# EAGLE design MoCAM80 (EAGLE 9.7.0)
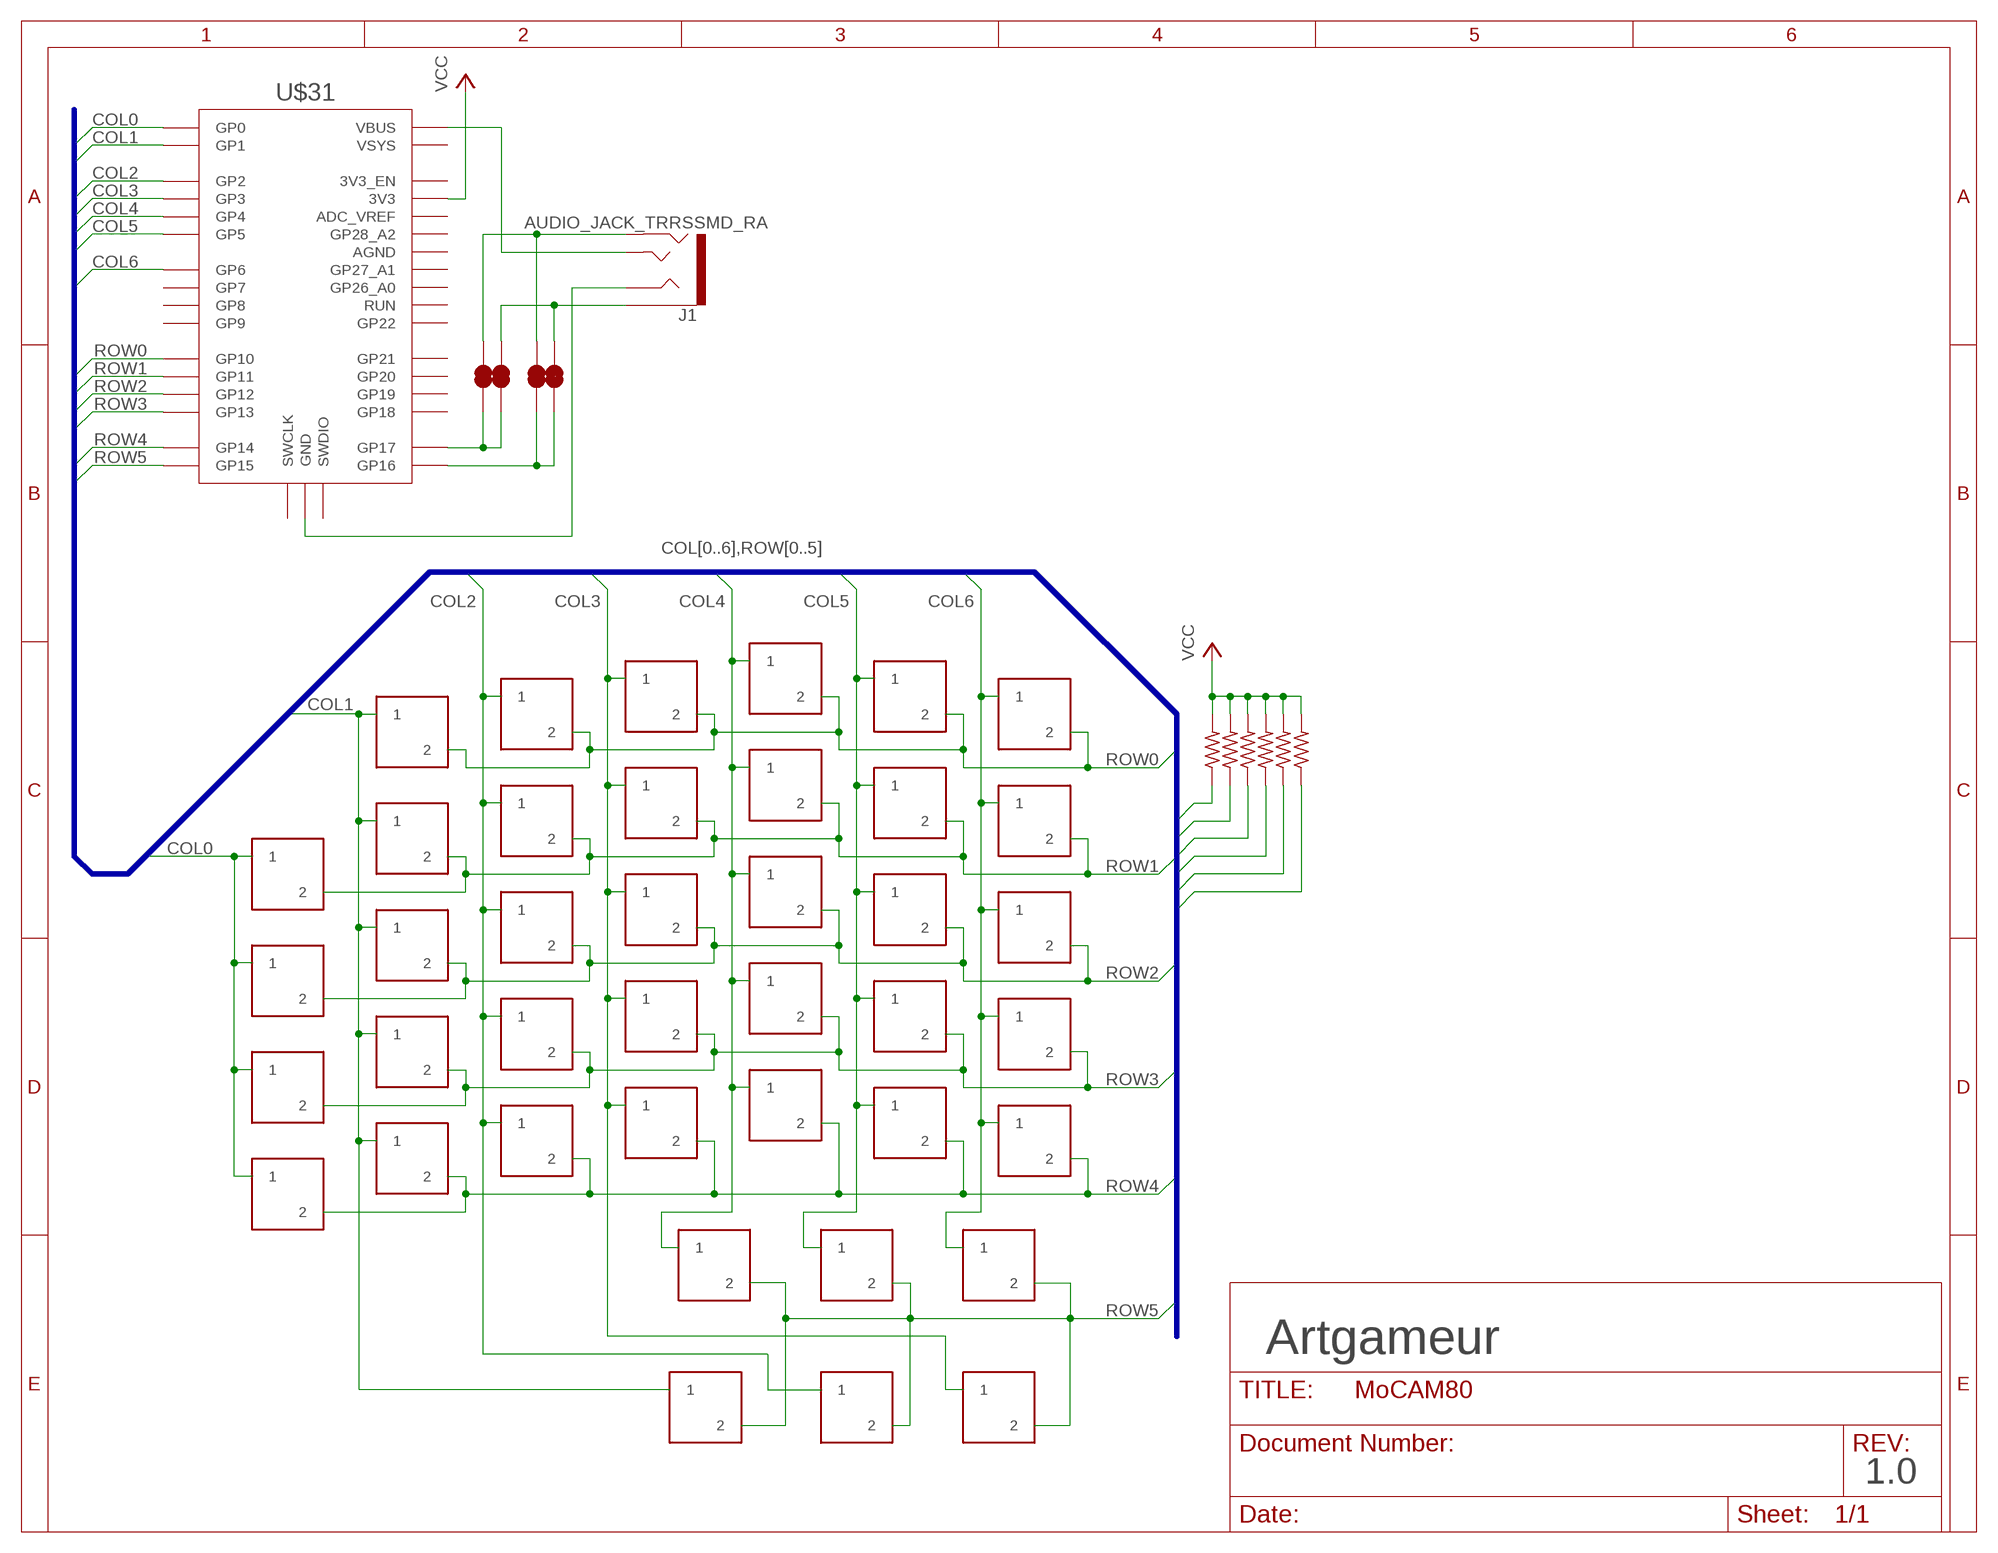
[diagram p0: schematic, sheet 1]

## Parts
J1  AUDIO_JACK_TRRSSMD_RA  [AUDIO_JACK_3.5MM_TRRS_SMD_RA]
JP1  JUMPER-SMT_2_NC_TRACE_NO-SILK  [SMT-JUMPER_2_NC_TRACE_NO-SILK]
JP2  JUMPER-SMT_2_NC_TRACE_NO-SILK  [SMT-JUMPER_2_NC_TRACE_NO-SILK]
JP3  JUMPER-SMT_2_NC_TRACE_NO-SILK  [SMT-JUMPER_2_NC_TRACE_NO-SILK]
JP4  JUMPER-SMT_2_NC_TRACE_NO-SILK  [SMT-JUMPER_2_NC_TRACE_NO-SILK]
R1  R-US_CHIP-1206(3216-METRIC)  [RESC3216X70]
R2  R-US_CHIP-1206(3216-METRIC)  [RESC3216X70]
R3  R-US_CHIP-1206(3216-METRIC)  [RESC3216X70]
R4  R-US_CHIP-1206(3216-METRIC)  [RESC3216X70]
R5  R-US_CHIP-1206(3216-METRIC)  [RESC3216X70]
R6  R-US_CHIP-1206(3216-METRIC)  [RESC3216X70]
U$1  KEYBOARD_SWITCHMX_CHOC_V2_SWAP  [MX_CHOC_V2_SWAP]
U$2  KEYBOARD_SWITCHMX_CHOC_V2_SWAP  [MX_CHOC_V2_SWAP]
U$3  KEYBOARD_SWITCHMX_CHOC_V2_SWAP  [MX_CHOC_V2_SWAP]
U$4  KEYBOARD_SWITCHMX_CHOC_V2_SWAP  [MX_CHOC_V2_SWAP]
U$5  KEYBOARD_SWITCHMX_CHOC_V2_SWAP  [MX_CHOC_V2_SWAP]
U$6  KEYBOARD_SWITCHMX_CHOC_V2_SWAP  [MX_CHOC_V2_SWAP]
U$7  KEYBOARD_SWITCHMX_CHOC_V2_SWAP  [MX_CHOC_V2_SWAP]
U$8  KEYBOARD_SWITCHMX_CHOC_V2_SWAP  [MX_CHOC_V2_SWAP]
U$9  KEYBOARD_SWITCHMX_CHOC_V2_SWAP  [MX_CHOC_V2_SWAP]
U$10  KEYBOARD_SWITCHMX_CHOC_V2_SWAP  [MX_CHOC_V2_SWAP]
U$11  KEYBOARD_SWITCHMX_CHOC_V2_SWAP  [MX_CHOC_V2_SWAP]
U$12  KEYBOARD_SWITCHMX_CHOC_V2_SWAP  [MX_CHOC_V2_SWAP]
U$13  KEYBOARD_SWITCHMX_CHOC_V2_SWAP  [MX_CHOC_V2_SWAP]
U$14  KEYBOARD_SWITCHMX_CHOC_V2_SWAP  [MX_CHOC_V2_SWAP]
U$15  KEYBOARD_SWITCHMX_CHOC_V2_SWAP  [MX_CHOC_V2_SWAP]
U$16  KEYBOARD_SWITCHMX_CHOC_V2_SWAP  [MX_CHOC_V2_SWAP]
U$17  KEYBOARD_SWITCHMX_CHOC_V2_SWAP  [MX_CHOC_V2_SWAP]
U$18  KEYBOARD_SWITCHMX_CHOC_V2_SWAP  [MX_CHOC_V2_SWAP]
U$19  KEYBOARD_SWITCHMX_CHOC_V2_SWAP  [MX_CHOC_V2_SWAP]
U$20  KEYBOARD_SWITCHMX_CHOC_V2_1.25  [MX_CHOC_V2_1.25]
U$21  KEYBOARD_SWITCHMX_CHOC_V2_SWAP  [MX_CHOC_V2_SWAP]
U$22  KEYBOARD_SWITCHMX_CHOC_V2_SWAP  [MX_CHOC_V2_SWAP]
U$23  KEYBOARD_SWITCHMX_CHOC_V2_SWAP  [MX_CHOC_V2_SWAP]
U$24  KEYBOARD_SWITCHMX_CHOC_V2_SWAP  [MX_CHOC_V2_SWAP]
U$25  KEYBOARD_SWITCHMX_CHOC_V2_1.25  [MX_CHOC_V2_1.25]
U$26  KEYBOARD_SWITCHMX_CHOC_V2_SWAP  [MX_CHOC_V2_SWAP]
U$27  KEYBOARD_SWITCHMX_CHOC_V2_SWAP  [MX_CHOC_V2_SWAP]
U$28  KEYBOARD_SWITCHMX_CHOC_V2_SWAP  [MX_CHOC_V2_SWAP]
U$29  KEYBOARD_SWITCHMX_CHOC_V2_SWAP  [MX_CHOC_V2_SWAP]
U$30  KEYBOARD_SWITCHMX_CHOC_V2_1.5  [MX_CHOC_V2_1.5]
U$31  RPI_PICO-SMD  [RPI_PICO]
U$32  KEYBOARD_SWITCHMX_CHOC_V2_SWAP  [MX_CHOC_V2_SWAP]
U$33  KEYBOARD_SWITCHMX_CHOC_V2_SWAP  [MX_CHOC_V2_SWAP]
U$34  KEYBOARD_SWITCHMX_CHOC_V2_SWAP  [MX_CHOC_V2_SWAP]
U$35  KEYBOARD_SWITCHMX_CHOC_V2_SWAP  [MX_CHOC_V2_SWAP]
U$36  KEYBOARD_SWITCHMX_CHOC_V2_SWAP  [MX_CHOC_V2_SWAP]
U$37  KEYBOARD_SWITCHMX_CHOC_V2_SWAP  [MX_CHOC_V2_SWAP]
U$38  KEYBOARD_SWITCHMX_CHOC_V2_SWAP  [MX_CHOC_V2_SWAP]
U$39  KEYBOARD_SWITCHMX_CHOC_V2_1.5  [MX_CHOC_V2_1.5]
U$40  KEYBOARD_SWITCHMX_CHOC_V2_1.5  [MX_CHOC_V2_1.5]
U$41  KEYBOARD_SWITCHMX_CHOC_V2_1.5  [MX_CHOC_V2_1.5]

## Nets
COL0: U$1.P$1 U$1.P$4 U$2.P$1 U$2.P$4 U$3.P$1 U$3.P$4 U$31.GP0 U$38.P$1 U$38.P$4
COL1: U$4.P$1 U$4.P$4 U$5.P$1 U$5.P$4 U$6.P$1 U$6.P$4 U$7.P$1 U$7.P$4 U$20.P$1 U$20.P$4 U$31.GP1 U$32.P$1 U$32.P$4
COL2: U$8.P$1 U$8.P$4 U$9.P$1 U$9.P$4 U$10.P$1 U$10.P$4 U$11.P$1 U$11.P$4 U$25.P$1 U$25.P$4 U$31.GP2 U$33.P$1 U$33.P$4
COL3: U$12.P$1 U$12.P$4 U$13.P$1 U$13.P$4 U$14.P$1 U$14.P$4 U$15.P$1 U$15.P$4 U$31.GP3 U$34.P$1 U$34.P$4 U$39.P$1 U$39.P$4
COL4: U$16.P$1 U$16.P$4 U$17.P$1 U$17.P$4 U$18.P$1 U$18.P$4 U$19.P$1 U$19.P$4 U$30.P$1 U$30.P$4 U$31.GP4 U$35.P$1 U$35.P$4
COL5: U$21.P$1 U$21.P$4 U$22.P$1 U$22.P$4 U$23.P$1 U$23.P$4 U$24.P$1 U$24.P$4 U$31.GP5 U$36.P$1 U$36.P$4 U$40.P$1 U$40.P$4
COL6: U$26.P$1 U$26.P$4 U$27.P$1 U$27.P$4 U$28.P$1 U$28.P$4 U$29.P$1 U$29.P$4 U$31.GP6 U$37.P$1 U$37.P$4 U$41.P$1 U$41.P$4
JACK_1: J1.TIP U$31.VBUS
JACK_2: J1.RING2 JP2.2 JP4.2
JACK_GND: J1.RING1 U$31.GND@1(GND) U$31.GND@2(GND) U$31.GND@3(GND) U$31.GND@4(GND) U$31.GND@5(GND) U$31.GND@6(GND) U$31.GND@7(GND) U$31.GND@8(GND)
JACK_TIP: J1.EARTH JP1.2 JP3.2
ROW0: R6.1 U$31.GP10 U$32.P$2 U$33.P$2 U$34.P$2 U$35.P$2 U$36.P$2 U$37.P$2
ROW1: R1.1 U$4.P$2 U$8.P$2 U$12.P$2 U$16.P$2 U$21.P$2 U$26.P$2 U$31.GP11 U$38.P$2
ROW2: R2.1 U$1.P$2 U$5.P$2 U$9.P$2 U$13.P$2 U$17.P$2 U$22.P$2 U$27.P$2 U$31.GP12
ROW3: R3.1 U$2.P$2 U$6.P$2 U$10.P$2 U$14.P$2 U$18.P$2 U$23.P$2 U$28.P$2 U$31.GP13
ROW4: R4.1 U$3.P$2 U$7.P$2 U$11.P$2 U$15.P$2 U$19.P$2 U$24.P$2 U$29.P$2 U$31.GP14
ROW5: R5.1 U$20.P$2 U$25.P$2 U$30.P$2 U$31.GP15 U$39.P$2 U$40.P$2 U$41.P$2
UART_RX: JP1.1 JP4.1 U$31.GP17
UART_TX: JP2.1 JP3.1 U$31.GP16
VCC: R1.2 R2.2 R3.2 R4.2 R5.2 R6.2 U$31.3V3
Unconnected: U$31.3V3_EN U$31.ADC_VREF U$31.AGND U$31.GP7 U$31.GP8 U$31.GP9 U$31.GP18 U$31.GP19 U$31.GP20 U$31.GP21 U$31.GP22 U$31.GP26_A0 U$31.GP27_A1 U$31.GP28_A2 U$31.RUN U$31.SWCLK U$31.SWDIO U$31.VSYS

## Buses
COL[0..6],ROW[0..5]

## Notes on the sheet
- Artgameur
- 1.0

## Library data of the parts
J1 = MoCAM80-Lib:AUDIO_JACK_TRRS: Audio Jack - 3.5mm TRRS (SMD) This is a 3.5mm TRRS SMD audio jack. TRRS connectors are the audio-style connectors that you see on some phones, MP3 players and development boards. TRRS stands for “tip, ring, ring, sleeve,” which reflects that this has three conductors and a ground. SparkFun Products: Audio Jack <https://www.sparkfun.com/products/12639> mbed Starter Kit <https://www.sparkfun.com/products/12968> SparkFun TRRS 3.5mm Jack Breakout <https://www.sparkfun.com/products/11570>
JP1-JP4 = MoCAM80-Lib:JUMPER-SMT_2_NC_TRACE: Normally closed trace jumper This jumper has a trace between two pads so it's normally closed (NC). Use a razor knife to open the connection. For best results follow the IPC guidelines for cutting traces: Cutout at least 0.063 mm (0.005 in). Remove all loose material to clean up the cut area. Seal the cut with an approved epoxy. Reapply solder to reclose the connection.
R1-R6 = MoCAM80-Lib:R-US: Resistor Fixed - ANSI
U$1-U$30 U$32-U$41 = MoCAM80-Lib:KEYBOARD_SWITCH
U$31 = MoCAM80-Lib:RPI_PICO

## Board
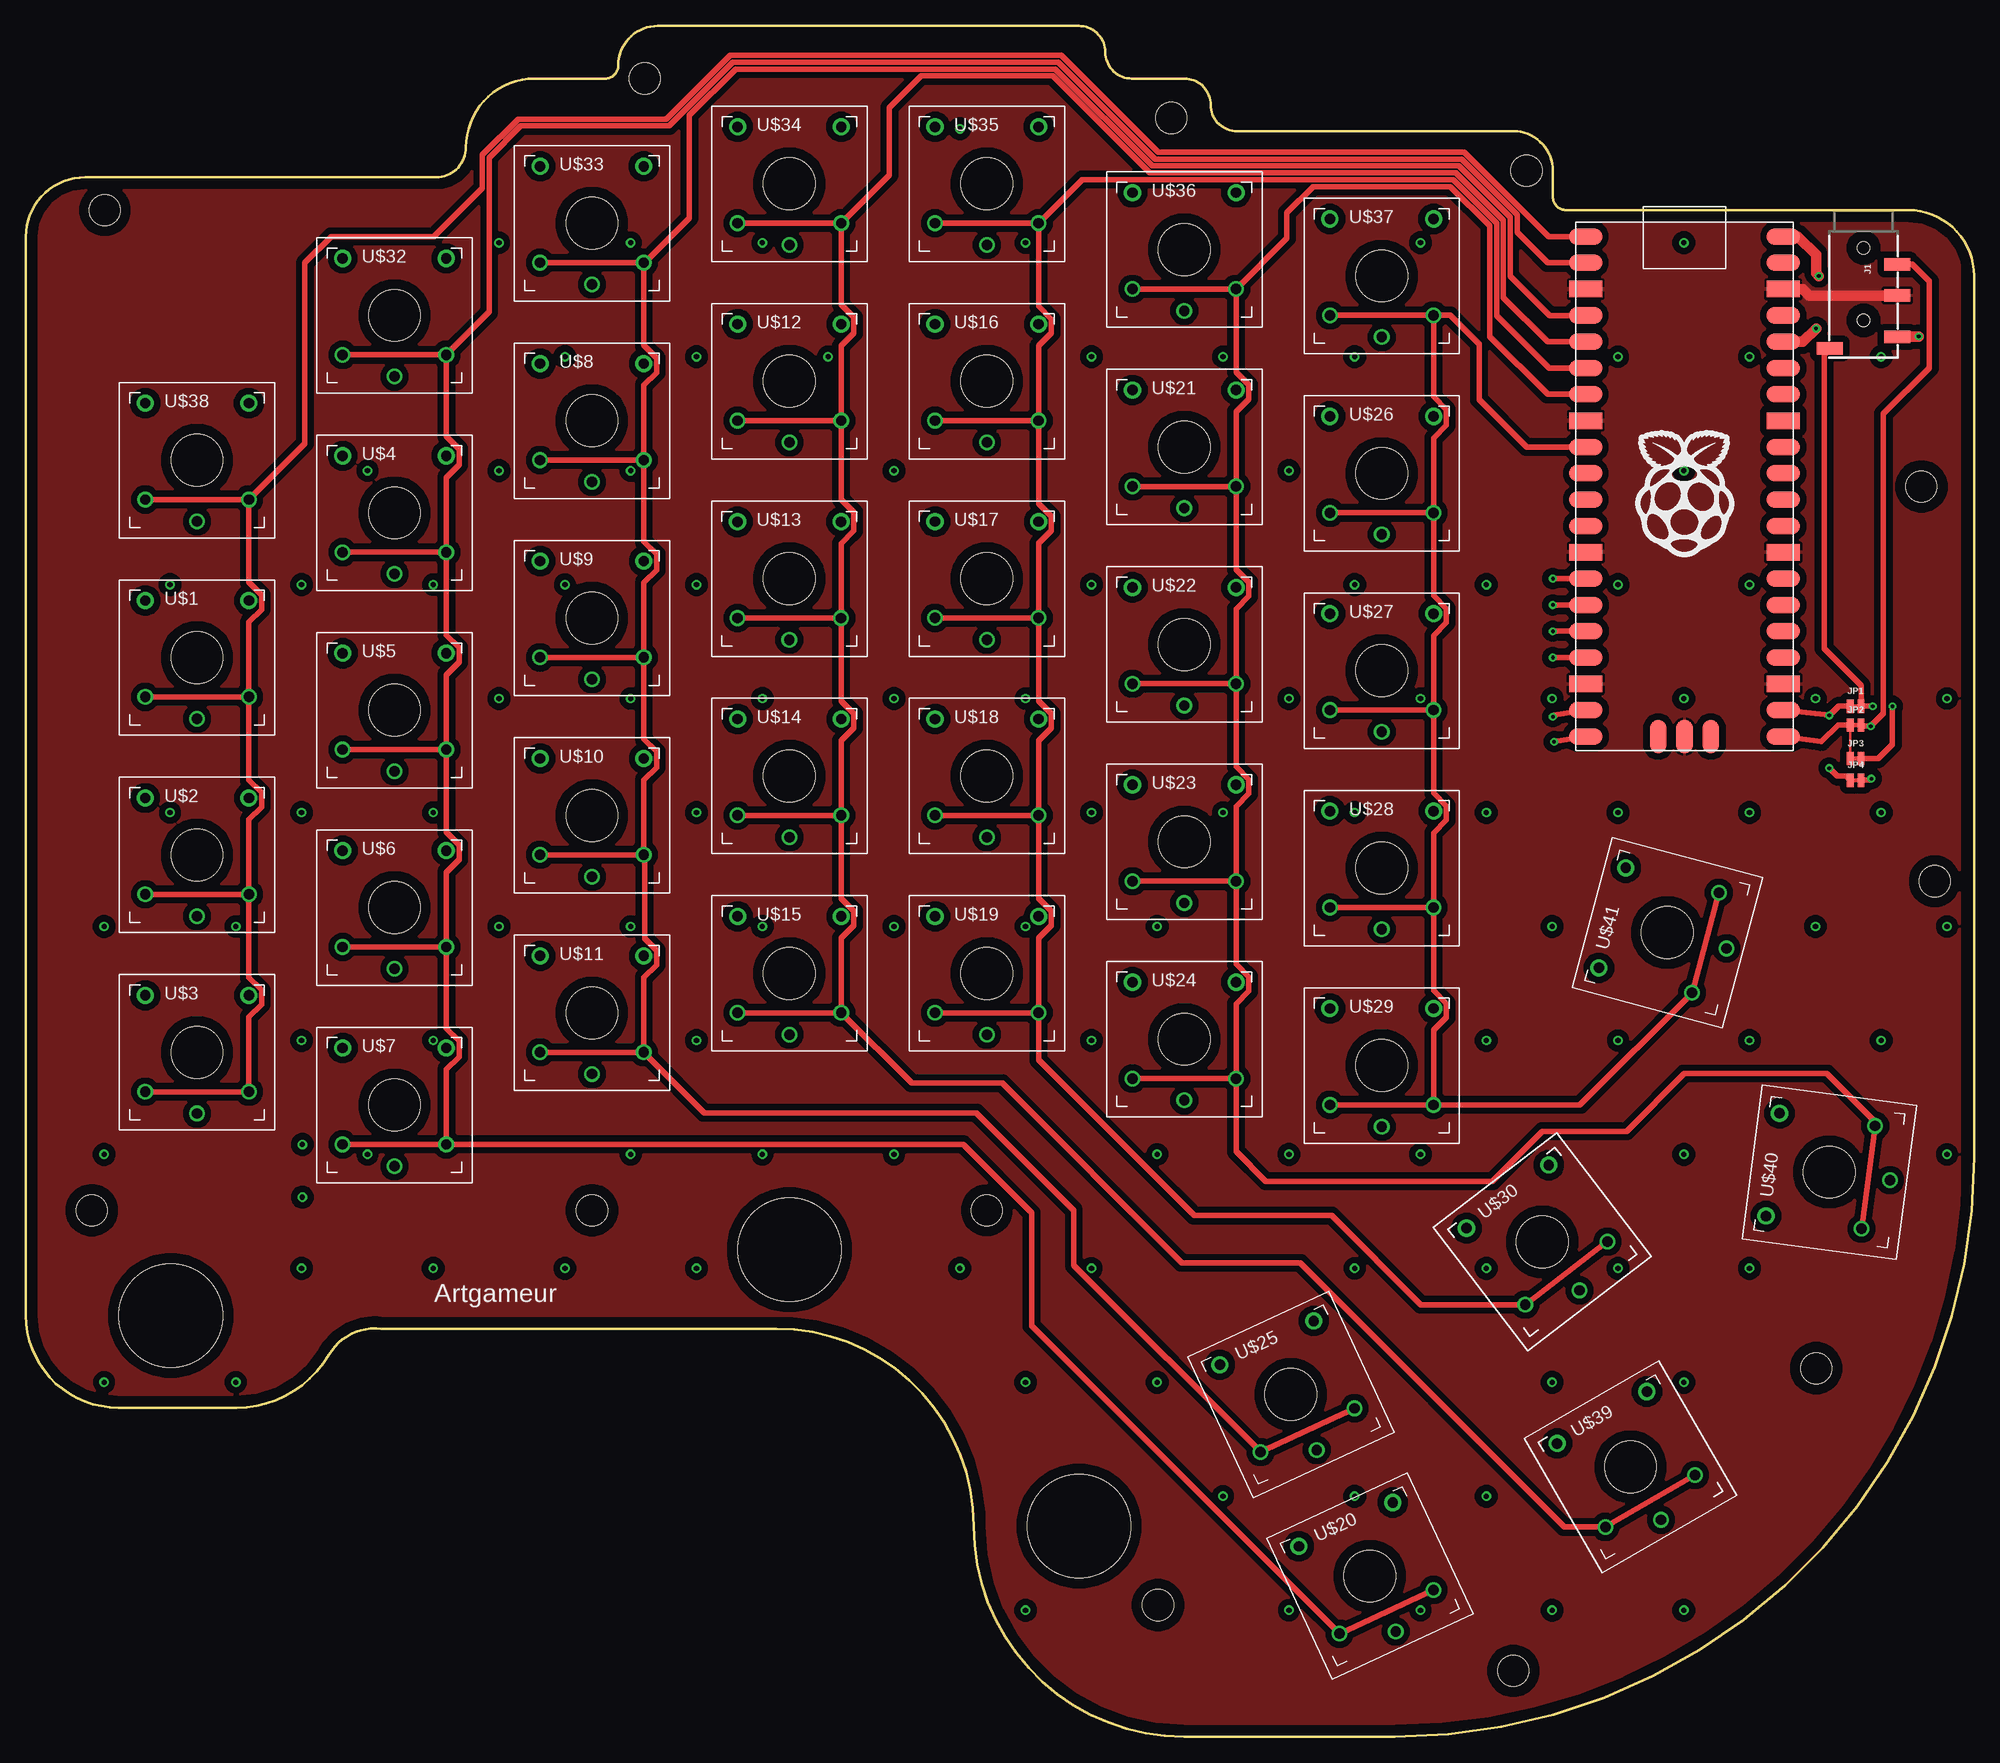
[diagram p1: board, top side]
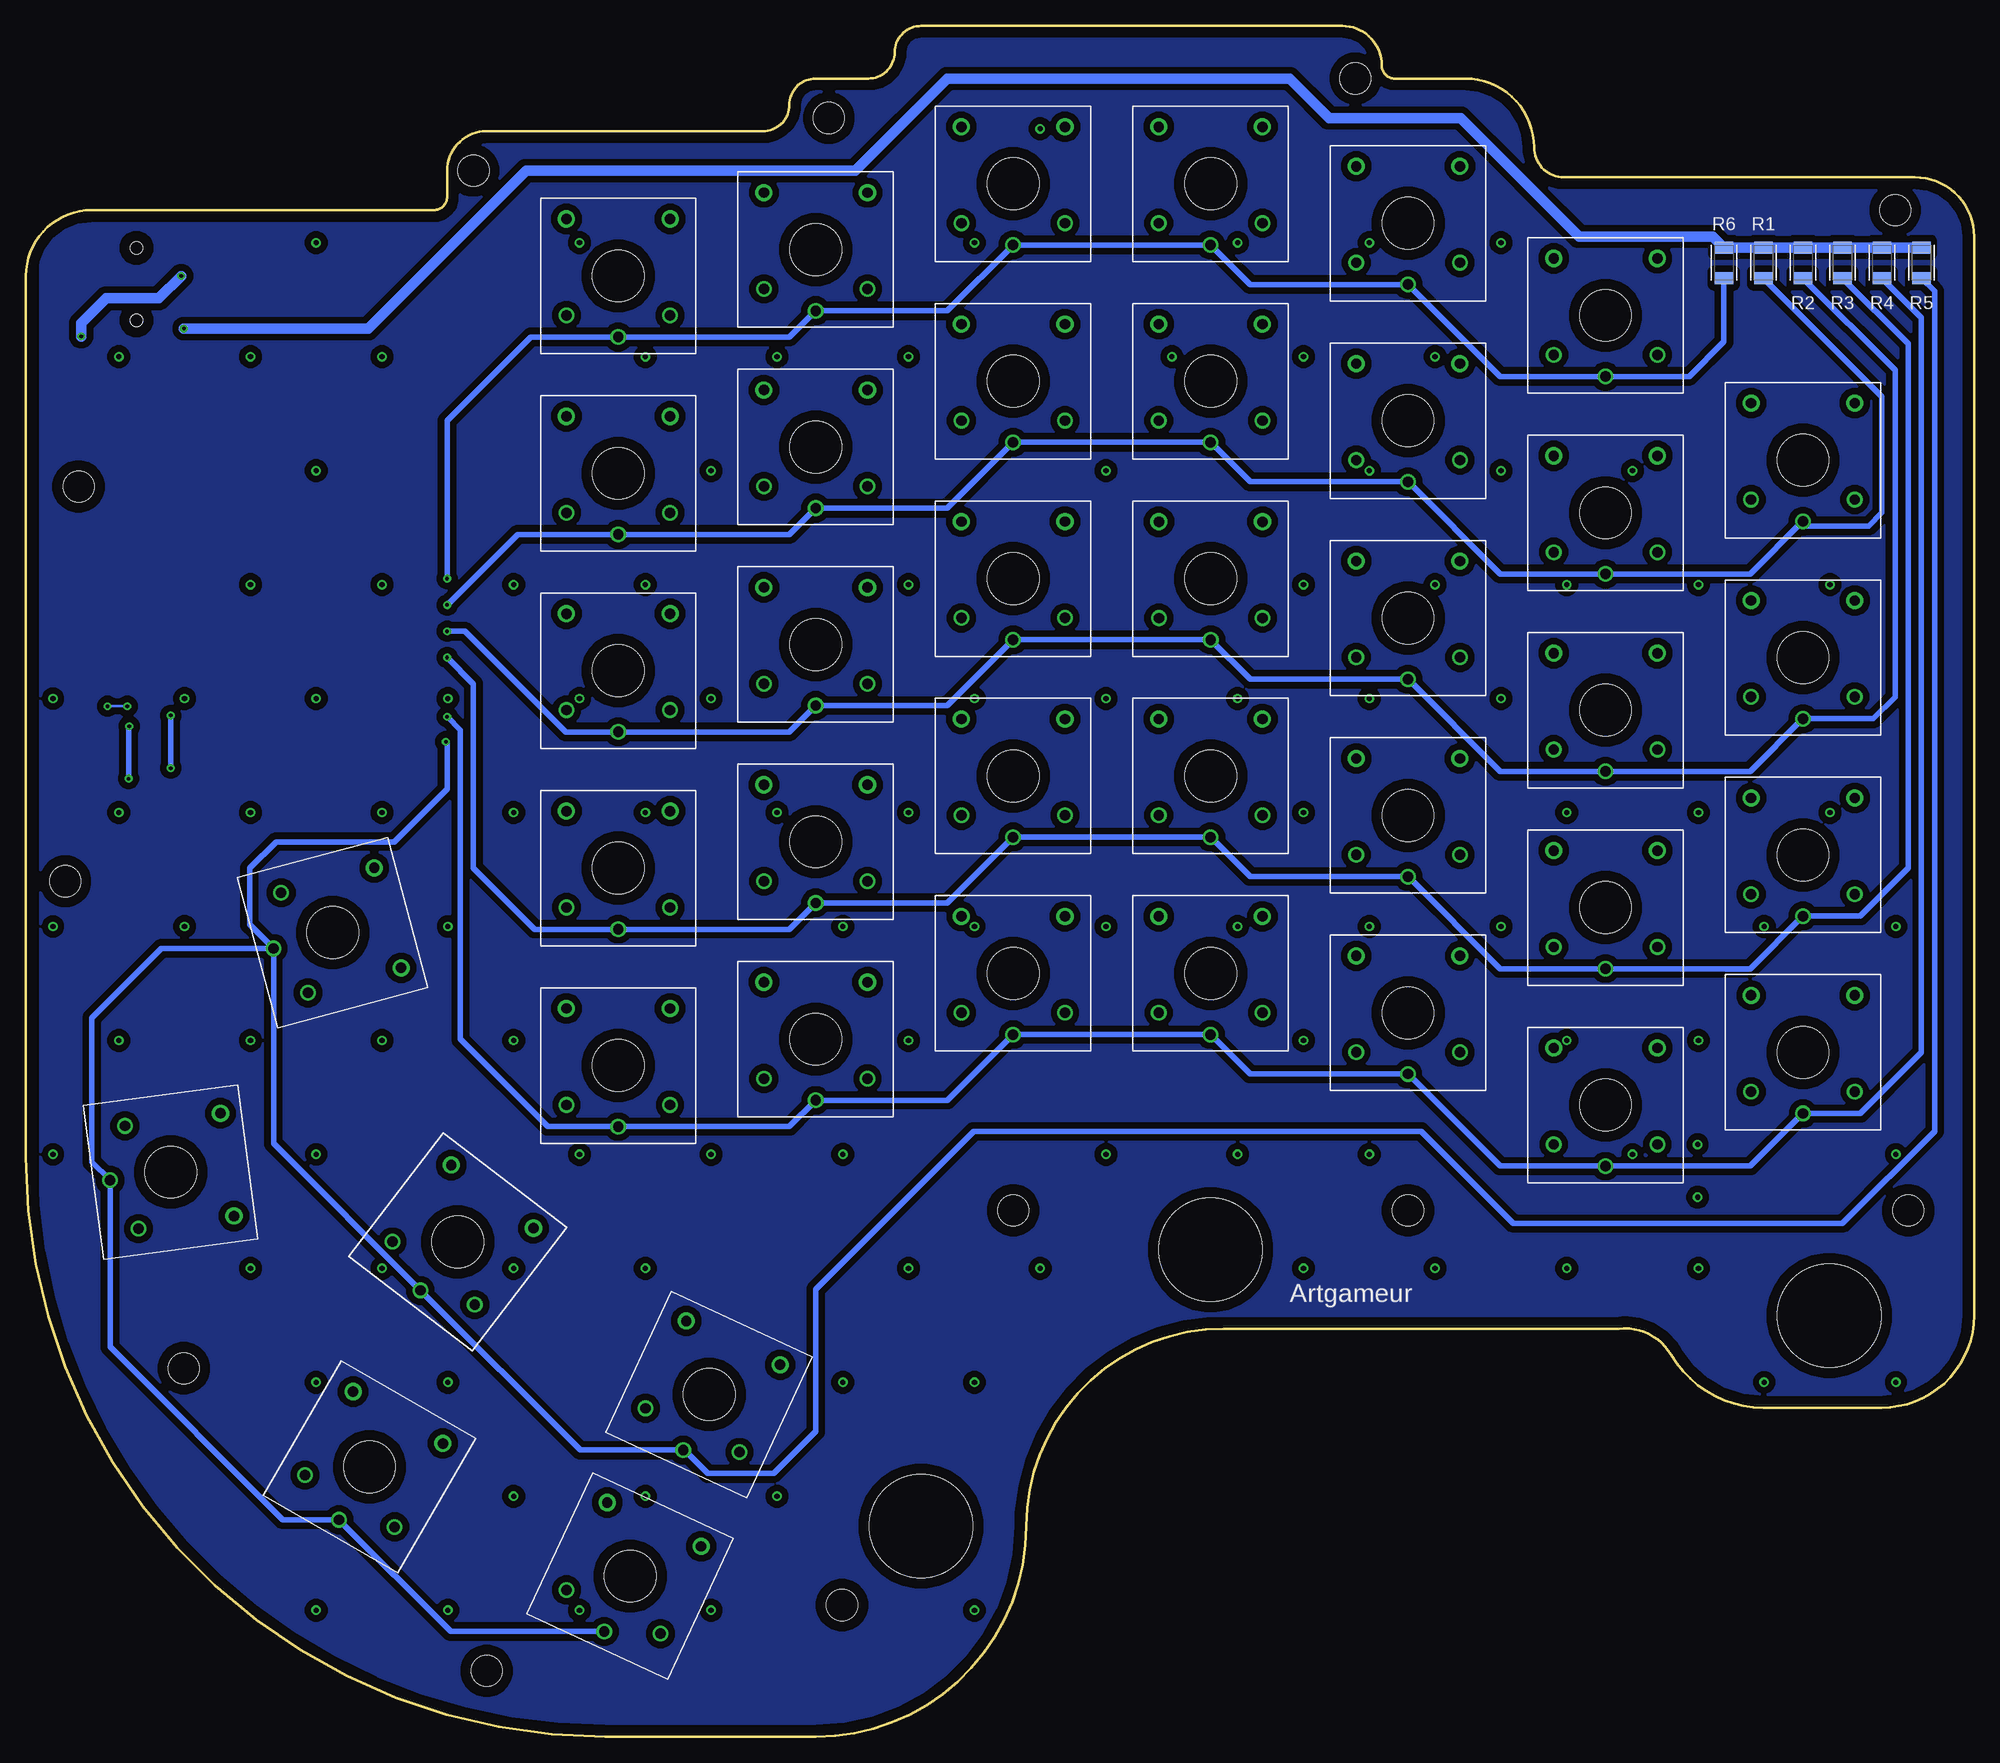
[diagram p2: board, bottom side, seen from below]

Size 187.96 x 165.1 mm. Coordinates in mm from the lower left corner, seen from the top.
Outline: 148.59,147.32 181.61,147.32 arc-90 187.96,140.97 187.96,55.88 arc-90 132.08,0 111.76,0 arc-90 91.44,20.32 arc90 72.39,39.37 34.29,39.37 arc66 29.21,36.83 arc-59 20.32,31.75 8.89,31.75 arc-90 0,40.64 0,144.78 arc-90 5.71,150.5 39.58,150.5 arc90 42.45,153.37 arc-90 49.1,160.02 55.88,160.02 arc90 57.15,161.29 arc-90 60.96,165.1 101.6,165.1 arc-90 104.14,162.56 arc90 106.68,160.02 111.76,160.02 arc-90 114.3,157.48 arc90 116.84,154.94 143.51,154.94 arc-90 147.32,151.13 147.32,148.59 arc90 148.59,147.32
Copper layers (1*16): Top / Bottom
Stack-up Default Layer Stack: Top SilkScreen Epoxy Ink / Top SolderMask SR:Green 0.0254mm Dk 4.3 / Top Surface Finish Lead-Free 0.02mm / Top CuFoil:007 0.035mm / Dielectric-1 User Defined 1.5mm / Bottom CuFoil:007 0.035mm / Bottom Surface Finish Lead-Free 0.02mm / Bottom SolderMask SR:Green 0.0254mm Dk 4.3 / Bottom SilkScreen Epoxy Ink
Design rules: minimum copper width 6mil, minimum drill size 0.35mm, copper clearance wire_polygon to wire_polygon 6mil, copper clearance wire_polygon to pad_smd 6mil, copper clearance wire_polygon to via 6mil, copper clearance pad_smd to pad_smd 6mil, copper clearance pad_smd to via 6mil, copper clearance via to via 6mil, copper clearance smd to pad (same net) 6mil, copper clearance smd to via (same net) 6mil, copper clearance smd to smd (same net) 6mil, dimension clearance 40mil, restrict clearance 0mil, via restrict clearance 0mil, drill distance 6mil, keepout clearance 0mil
Holes 3 mm at 7.62,147.32 59.69,160.02 110.49,156.21 144.78,151.13 182.88,120.65 184.15,82.55 109.22,12.7 92.71,50.8 54.61,50.8 6.35,50.8 143.51,6.35 172.72,35.56
Holes 10 mm at 13.97,40.64 73.66,46.99 101.6,20.32

### Footprints (pad centres in the part's own frame; a part is rotated, then mirrored left to right if it is on the bottom)
AUDIO_JACK_3.5MM_TRRS_SMD_RA = smd 1.2 x 2.5: EARTH 11.3,-3.25; RING1 6.2,3.25; RING2 3.2,3.25; TIP 10.2,3.25 | hole 1.2: 1.6,0; 8.6,0
SMT-JUMPER_2_NC_TRACE_NO-SILK = smd 0.66 x 1.27: 1 -0.521,0; 2 0.521,0
RESC3216X70 = smd 1.165 x 1.815: 1 -1.475,0; 2 1.475,0
MX_CHOC_V2_SWAP = drill 1 pad 1.35: P$1 -5,-3.8; P$2 0,-5.9; P$4 5,-3.8 | drill 1 pad 1.65: P$3 5,5.5; P$5 -5,5.5 | hole 5: 0,0
MX_CHOC_V2_1.25 = drill 1 pad 1.35: P$1 -5,-3.8; P$2 0,-5.9; P$4 5,-3.8 | drill 1 pad 1.65: P$3 5,5.5; P$5 -5,5.5 | hole 5: 0,0
MX_CHOC_V2_1.5 = drill 1 pad 1.35: P$1 -5,-3.8; P$2 0,-5.9; P$4 5,-3.8 | drill 1 pad 1.65: P$3 5,5.5; P$5 -5,5.5 | hole 5: 0,0
RPI_PICO = smd 3.2 x 1.6: 3V3 9.525,13.97; 3V3_EN 9.525,16.51; ADC_VREF 9.525,11.43; AGND 9.525,6.35; GND@1 -9.525,19.05; GND@2 -9.525,6.35; GND@3 -9.525,-6.35; GND@4 -9.525,-19.05; GND@6 9.525,-19.05; GND@7 9.525,-6.35; GND@8 9.525,19.05; GP0 -9.525,24.13; GP1 -9.525,21.59; GP2 -9.525,16.51; GP3 -9.525,13.97; GP4 -9.525,11.43; GP5 -9.525,8.89; GP6 -9.525,3.81; GP7 -9.525,1.27; GP8 -9.525,-1.27; GP9 -9.525,-3.81; GP10 -9.525,-8.89; GP11 -9.525,-11.43; GP12 -9.525,-13.97; GP13 -9.525,-16.51; GP14 -9.525,-21.59; GP15 -9.525,-24.13; GP16 9.525,-24.13; GP17 9.525,-21.59; GP18 9.525,-16.51; GP19 9.525,-13.97; GP20 9.525,-11.43; GP21 9.525,-8.89; GP22 9.525,-3.81; GP26_A0 9.525,1.27; GP27_A1 9.525,3.81; GP28_A2 9.525,8.89; RUN 9.525,-1.27; VBUS 9.525,24.13; VSYS 9.525,21.59 | smd 1.6 x 3.2: GND@5 0,-24.13; SWCLK -2.54,-24.13; SWDIO 2.54,-24.13

### Placement (x,y rotation side)
J1  177.29,145.29 270 top
JP1  176.53,99.44 0 top
JP2  176.53,97.64 0 top
JP3  176.53,94.39 0 top
JP4  176.53,92.3 0 top
R1  20.32,142.24 90 bottom
R2  16.51,142.24 90 bottom
R3  12.7,142.24 90 bottom
R4  8.89,142.24 90 bottom
R5  5.08,142.24 90 bottom
R6  24.13,142.24 90 bottom
U$1  16.51,104.14 0 top
U$2  16.51,85.09 0 top
U$3  16.51,66.04 0 top
U$4  35.56,118.11 0 top
U$5  35.56,99.06 0 top
U$6  35.56,80.01 0 top
U$7  35.56,60.96 0 top
U$8  54.61,127 0 top
U$9  54.61,107.95 0 top
U$10  54.61,88.9 0 top
U$11  54.61,69.85 0 top
U$12  73.66,130.81 0 top
U$13  73.65,111.75 0 top
U$14  73.66,92.71 0 top
U$15  73.66,73.66 0 top
U$16  92.71,130.81 0 top
U$17  92.71,111.76 0 top
U$18  92.71,92.71 0 top
U$19  92.71,73.66 0 top
U$20  129.67,15.49 25 top
U$21  111.76,124.46 0 top
U$22  111.76,105.41 0 top
U$23  111.76,86.36 0 top
U$24  111.76,67.31 0 top
U$25  122.05,33.02 25 top
U$26  130.81,121.92 0 top
U$27  130.81,102.87 0 top
U$28  130.81,83.82 0 top
U$29  130.81,64.77 0 top
U$30  146.3,47.75 37.5 top
U$31  160.02,120.65 0 top
U$32  35.56,137.16 0 top
U$33  54.61,146.05 0 top
U$34  73.66,149.86 0 top
U$35  92.71,149.86 0 top
U$36  111.76,143.51 0 top
U$37  130.81,140.97 0 top
U$38  16.51,123.19 0 top
U$39  154.81,26.04 30 top
U$40  173.99,54.48 82.5 top
U$41  158.37,77.6 75 top

### Tracks (layer width: path | path; a pad name or v marks a point on that pad's centre or on a via)
COL0
  Top 0.508: U$38.P$1 U$38.P$4 | U$1.P$1 U$1.P$4 | U$2.P$1 U$2.P$4 | U$3.P$1 U$3.P$4 21.51,69.45 22.74,70.68 22.74,72.05 21.51,73.28 U$2.P$4 | U$2.P$4 21.51,88.5 22.74,89.73 22.74,91.1 21.51,92.33 U$1.P$4 | U$1.P$4 21.51,107.55 22.74,108.78 22.74,110.18 21.51,111.41 U$38.P$4 | U$38.P$4 26.92,124.8 26.92,142.24 29.46,144.78 39.37,144.78 44.04,149.45 44.04,152.67 47.48,156.11 61.78,156.11 67.93,162.25 99.88,162.25 109.23,152.91 138.78,152.91 146.91,144.78 U$31.GP0
COL1
  Top 0.508: U$32.P$1 U$32.P$4 | U$4.P$1 U$4.P$4 | U$7.P$1 U$7.P$4 | U$6.P$1 U$6.P$4 | U$5.P$1 U$5.P$4 | U$4.P$4 40.56,121.52 41.79,122.75 41.79,124.28 40.56,125.51 U$32.P$4 | U$7.P$4 40.56,64.37 41.79,65.6 41.79,67.13 40.56,68.36 U$6.P$4 | U$6.P$4 40.56,83.42 41.79,84.65 41.79,86.05 40.56,87.28 U$5.P$4 | U$5.P$4 40.56,102.47 41.79,103.7 41.79,105.1 40.56,106.33 U$4.P$4 | U$7.P$4 90.41,57.16 97.03,50.55 97.03,39.65 U$20.P$1 U$20.P$4 | U$32.P$4 44.7,137.5 44.7,152.4 47.75,155.45 62.06,155.45 68.2,161.59 99.61,161.59 108.95,152.25 138.51,152.25 143.87,146.89 143.87,145.19 146.81,142.24 U$31.GP1
COL2
  Top 0.508: U$33.P$4 U$33.P$1 | U$11.P$1 U$11.P$4 | U$10.P$1 U$10.P$4 | U$9.P$1 U$9.P$4 | U$8.P$1 U$8.P$4 | U$11.P$4 59.61,73.26 60.84,74.49 60.84,75.89 59.69,77.04 59.69,85.09 59.68,85.1 U$10.P$4 | U$10.P$4 59.61,92.31 60.84,93.54 60.84,95.07 59.61,96.3 U$9.P$4 | U$9.P$4 59.61,111.36 60.84,112.59 60.84,114.12 59.61,115.35 U$8.P$4 | U$8.P$4 59.61,130.41 60.84,131.64 60.84,133.04 59.61,134.27 U$33.P$4 | U$11.P$4 65.46,60.2 91.69,60.2 101.09,50.8 101.09,45.49 U$25.P$1 U$25.P$4 | U$33.P$4 59.7,142.25 64.01,146.56 64.01,156.46 68.48,160.93 99.33,160.93 108.68,151.59 138.24,151.59 143.21,146.62 143.21,140.97 147.01,137.16 U$31.GP2
COL3
  Top 0.508: U$34.P$4 U$34.P$1 | U$15.P$1 U$15.P$4 | U$14.P$1 U$14.P$4 | U$12.P$1 U$12.P$4 | U$13.P$1 U$13.P$4 | U$39.P$4 U$39.P$1 148.41,20.24 122.94,45.72 111.52,45.72 94.17,63.06 85.45,63.06 U$15.P$4 | U$15.P$4 78.66,77.07 79.89,78.3 79.89,79.67 78.66,80.9 U$14.P$4 | U$13.P$4 78.66,99.95 79.89,98.72 79.89,97.35 78.66,96.12 U$14.P$4 | U$13.P$4 78.65,115.16 79.88,116.39 79.88,118.17 78.66,119.39 U$12.P$4 | U$12.P$4 78.66,134.22 79.89,135.45 79.89,136.98 78.66,138.21 U$34.P$4 | U$34.P$4 83.31,150.71 83.31,157.23 86.36,160.27 99.06,160.27 108.41,150.93 137.96,150.93 142.54,146.34 142.54,138.89 146.81,134.62 U$31.GP3
COL4
  Top 0.508: U$35.P$4 U$35.P$1 | U$16.P$1 U$16.P$4 | U$17.P$1 U$17.P$4 | U$18.P$1 U$18.P$4 | U$19.P$1 U$19.P$4 | U$19.P$4 97.71,77.07 98.94,78.3 98.94,79.67 97.71,80.9 U$18.P$4 | U$18.P$4 97.71,96.12 98.94,97.35 98.94,98.72 97.71,99.95 U$17.P$4 | U$17.P$4 97.71,115.17 98.94,116.4 98.94,117.77 97.71,119 U$16.P$4 | U$16.P$4 97.71,134.22 98.94,135.45 98.94,136.82 97.71,138.05 U$35.P$4 | U$30.P$4 U$30.P$1 134.58,41.69 125.98,50.29 112.71,50.29 97.71,65.29 U$19.P$4 | U$35.P$4 101.92,150.27 137.69,150.27 141.88,146.07 141.88,137.16 146.96,132.08 U$31.GP4
COL5
  Top 0.508: U$36.P$4 U$36.P$1 | U$24.P$1 U$24.P$4 | U$23.P$1 U$23.P$4 | U$22.P$1 U$22.P$4 | U$21.P$1 U$21.P$4 | U$24.P$4 116.76,70.72 117.99,71.95 117.99,73.32 116.76,74.55 U$23.P$4 | U$23.P$4 116.76,89.77 117.99,91 117.99,92.37 116.76,93.6 U$22.P$4 | U$22.P$4 116.76,108.82 117.99,110.05 117.99,111.42 116.76,112.65 U$21.P$4 | U$21.P$4 116.76,127.87 117.99,129.1 117.99,130.47 116.76,131.7 U$36.P$4 | U$40.P$1 U$40.P$4 178.41,59.33 173.74,64.01 160.02,64.01 154.43,58.42 146.3,58.42 141.48,53.59 119.63,53.59 116.76,56.47 U$24.P$4 | U$36.P$4 121.67,144.62 121.67,147.07 124.21,149.61 137.41,149.61 141.22,145.8 141.22,135.13 146.81,129.54 U$31.GP5
COL6
  Top 0.508: U$29.P$1 U$29.P$4 | U$28.P$4 U$28.P$1 | U$27.P$1 U$27.P$4 | U$26.P$1 U$26.P$4 | U$37.P$4 U$37.P$1 | U$29.P$4 135.81,68.18 137.04,69.41 137.04,70.78 135.81,72.01 U$28.P$4 | U$28.P$4 135.81,87.23 137.04,88.46 137.04,89.83 135.81,91.06 U$27.P$4 | U$27.P$4 135.81,106.28 137.04,107.51 137.04,108.88 135.81,110.11 U$26.P$4 | U$26.P$4 135.81,125.33 137.04,126.56 137.04,128.09 135.81,129.32 U$37.P$4 | U$41.P$4 U$41.P$1 149.93,60.97 U$29.P$4 | U$37.P$4 137.4,137.17 140.21,134.37 140.21,129.03 144.78,124.46 U$31.GP6
JACK_1  (via drill 0.35)
  Top 1.016: v172.97,140.97 172.72,141.22 172.72,143 170.94,144.78 U$31.VBUS | J1.TIP 182.63,135.09 v182.63,135.13
  Bottom 1.016: v182.63,135.13 182.63,136.39 180.2,138.81 175.13,138.81 v172.97,140.97
JACK_2  (via drill 0.35)
  Top 0.508: J1.RING2 182.02,142.09 183.64,140.46 183.64,132.08 179.22,127.66 179.22,98.73 v178,97.51 177.18,97.51 JP2.2 | v178.05,92.46 177.9,92.3 JP4.2
  Bottom 0.508: v178,97.51 178.05,97.45 v178.05,92.46
JACK_GND
  Top 1.016: J1.RING1 172.06,139.09 171.45,139.7 U$31.GND@8
  pour Top (isolate 0.635): 0,165.1 186.69,165.1 186.69,0 0,0
  pour Bottom (isolate 0.635): 0,165.1 186.69,165.1 186.69,0 0,0
JACK_TIP  (via drill 0.35)
  Top 0.508: JP3.2 178.71,94.39 180.09,95.76 v180.09,99.44 | v178.18,99.44 JP1.2 177.05,101.46 173.48,105.03 173.48,133.35 174.04,133.91 J1.EARTH
  Bottom 0.254: v178.18,99.44 v180.09,99.44
N$1  (via drill 0.51)
  other vias: 96.45,144.18 71.05,144.18 45.65,144.18 166.3,133.18 115.5,133.18 64.7,133.18 159.95,122.18 83.75,122.18 58.35,122.18 32.95,122.18 153.6,111.18 128.2,111.18 102.8,111.18 52,111.18 26.6,111.18 172.65,100.18 147.25,100.18 121.85,100.18 96.45,100.18 71.05,100.18 45.65,100.18 166.3,89.19 140.9,89.19 115.5,89.19 64.7,89.19 39.3,89.19 13.9,89.19 185.35,78.19 109.15,78.19 83.75,78.19 147.25,12.2 121.85,12.2 96.45,12.2 128.2,23.2 7.55,34.19 109.15,34.19 159.95,34.19 39.3,45.19 64.7,45.19 90.1,45.19 140.9,45.19 166.3,45.19 71.05,56.19 121.85,56.19 26.6,67.19 102.8,67.19 153.6,67.19 179,67.19 7.55,78.19 58.35,78.19 90.1,155.17 159.95,144.18 134.55,144.18 58.35,144.18 179,133.18 153.6,133.18 128.2,133.18 102.8,133.18 77.4,133.18 52,133.18 121.85,122.18 45.65,122.18 166.3,111.18 140.9,111.18 64.7,111.18 39.3,111.18 13.9,111.18 185.35,100.18 159.95,100.18 134.55,100.18 83.75,100.18 58.35,100.18 179,89.19 153.6,89.19 128.2,89.19 102.8,89.19 26.6,89.19 172.65,78.19 147.25,78.19 96.45,78.19 71.05,78.19 115.5,23.2 159.95,12.2 134.55,12.2 140.9,23.2 20.25,34.19 96.45,34.19 147.25,34.19 26.6,45.19 52,45.19 102.8,45.19 128.2,45.19 153.6,45.19 7.55,56.19 32.95,56.19 58.35,56.19 83.75,56.19 109.15,56.19 134.55,56.19 159.95,56.19 185.35,56.19 39.3,67.19 64.7,67.19 140.9,67.19 166.3,67.19 20.25,78.19 45.65,78.19
N$2  (via drill 0.51)
  other vias: 26.67,57.15
N$3  (via drill 0.51)
  other vias: 26.67,52.07
ROW0  (via drill 0.35)
  Top 0.508: v147.32,111.76 U$31.GP10
  Bottom 0.508: R6.1 24.13,134.62 27.49,131.26 U$32.P$2 45.72,131.26 U$33.P$2 69.85,140.15 U$34.P$2 U$35.P$2 99.06,137.61 U$36.P$2 114.3,135.07 U$37.P$2 139.25,135.07 147.32,127 v147.32,111.76
ROW1  (via drill 0.35)
  Top 0.508: U$31.GP11 v147.32,109.22
  Bottom 0.508: R1.1 8.89,129.34 8.89,118.11 10.16,116.84 16.06,116.84 U$38.P$2 21.59,112.21 U$4.P$2 45.72,112.21 U$8.P$2 69.85,121.1 U$12.P$2 U$16.P$2 99.06,118.56 U$21.P$2 114.3,116.02 U$26.P$2 140.52,116.02 v147.32,109.22
ROW2  (via drill 0.35)
  Top 0.508: v147.32,106.68 U$31.GP12
  Bottom 0.508: R2.1 7.62,131.88 7.62,100.33 9.71,98.24 U$1.P$2 21.59,93.16 U$5.P$2 45.72,93.16 U$9.P$2 69.85,102.05 U$13.P$2 73.66,105.86 U$17.P$2 99.06,99.51 U$22.P$2 114.3,96.97 U$27.P$2 135.89,96.97 145.6,106.68 v147.32,106.68
ROW3  (via drill 0.35)
  Top 0.508: U$31.GP13 v147.32,104.14
  Bottom 0.508: R3.1 6.35,134.41 6.35,83.82 10.98,79.19 U$2.P$2 21.59,74.11 U$6.P$2 45.72,74.11 U$10.P$2 69.85,83 U$14.P$2 U$18.P$2 99.06,80.46 U$23.P$2 114.3,77.92 U$28.P$2 138.88,77.92 144.78,83.82 144.78,101.6 v147.32,104.14
ROW4  (via drill 0.35)
  Top 0.508: v147.32,98.42 147.47,98.57 U$31.GP14
  Bottom 0.508: R4.1 5.08,136.96 5.08,66.04 10.98,60.14 U$3.P$2 21.59,55.06 U$7.P$2 45.72,55.06 U$11.P$2 69.85,63.95 U$15.P$2 U$19.P$2 99.06,61.41 U$24.P$2 114.3,58.87 U$29.P$2 137.61,58.87 146.05,67.31 146.05,97.16 v147.32,98.42
ROW5  (via drill 0.35)
  Top 0.508: v147.45,96.01 147.47,96.03 U$31.GP15
  Bottom 0.508: R5.1 3.81,139.5 3.81,58.42 12.7,49.53 44.45,49.53 53.34,58.42 96.52,58.42 111.76,43.18 111.76,29.46 115.82,25.4 122.17,25.4 124.45,27.67 U$25.P$2 134.5,27.67 U$30.P$2 164.07,57.24 U$41.P$2 | U$41.P$2 174.88,76.07 181.61,69.34 181.61,55.48 U$40.P$2 179.84,37.6 163.16,20.93 U$39.P$2 146.98,10.15 U$20.P$2 | U$41.P$2 166.37,78.37 166.37,83.82 163.83,86.36 152.4,86.36 147.32,91.44 147.32,95.89 v147.45,96.01
UART_RX  (via drill 0.35)
  Top 0.254: v173.99,98.55 173.97,98.57
  Top 0.508: v173.99,98.55 174.88,99.44 JP1.1 | 173.97,98.57 U$31.GP17 | JP4.1 175.63,92.69 174.78,92.69 v173.99,93.47
  Bottom 0.508: v173.99,93.47 v173.99,98.55
UART_TX
  Top 0.254: JP2.1 JP3.1
  Top 0.508: JP2.1 174.84,97.64 173.23,96.03 U$31.GP16
VCC  (via drill 0.35)
  Top 1.016: v172.72,135.89 171.45,134.62 U$31.3V3
  Bottom 1.016: R5.2 R4.2 R3.2 R2.2 R1.2 R6.2 25.2,144.78 38.1,144.78 49.53,156.21 62.23,156.21 66.04,160.02 99.06,160.02 107.95,151.13 139.7,151.13 154.94,135.89 v172.72,135.89

### Text on the board
SilkscreenTop: Artgameur
SilkscreenBottom: Artgameur